# Altium schematic sheet bluetooth_candle.SchDoc
size B
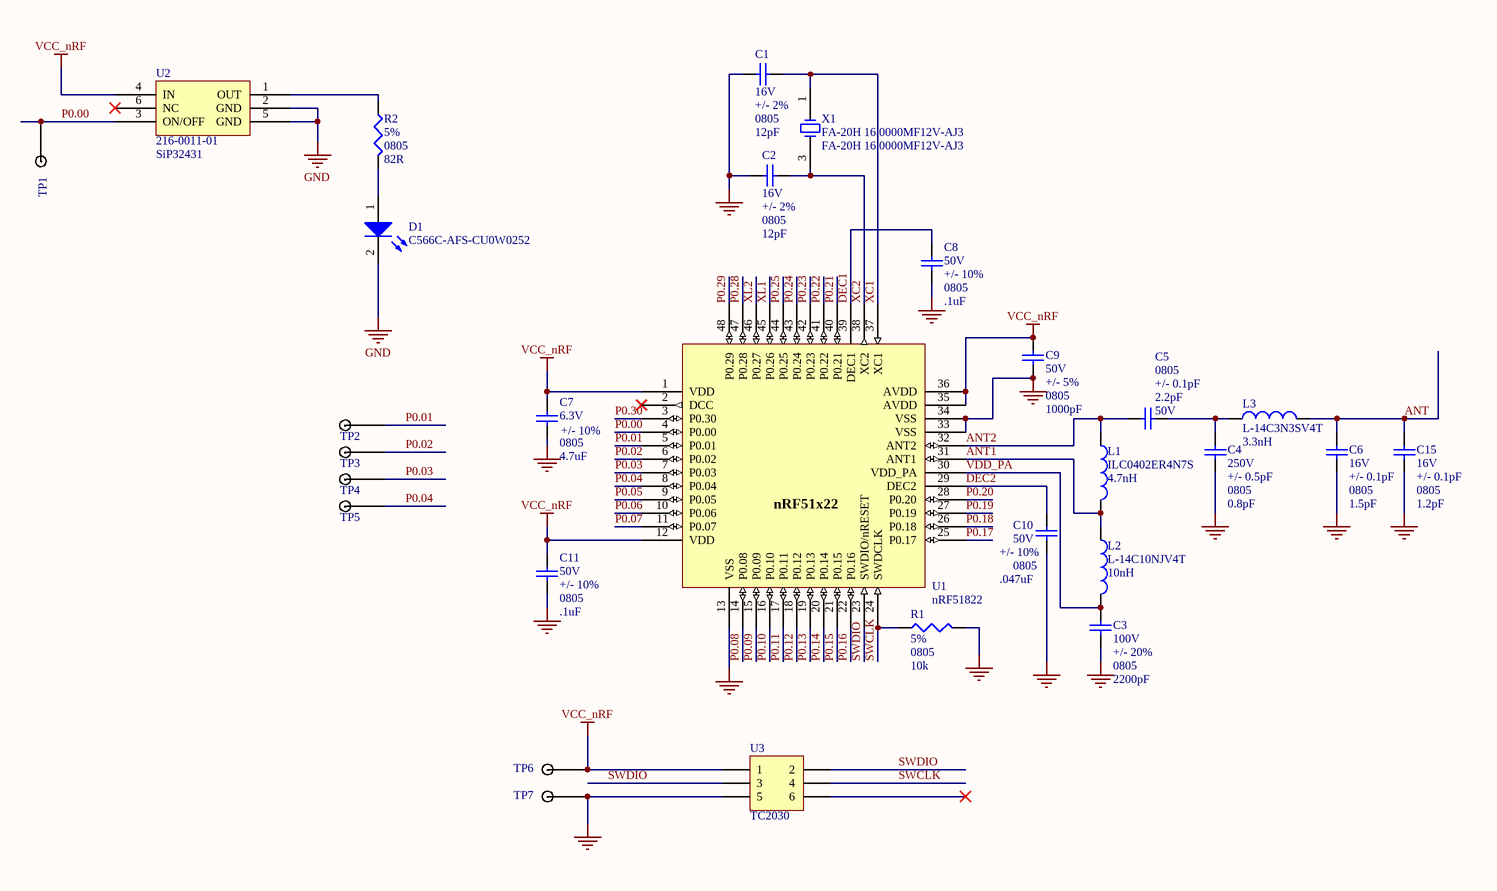
[diagram p0: bluetooth_candle.SchDoc]

## Parts
C1  value 12pF  Voltage: 16V  Tolerance: +/- 2%  PackageReference: 0805  [0805_Capacitor]  (hidden comment: VJ0805A120GXJCW1BC)
C2  value 12pF  Voltage: 16V  Tolerance: +/- 2%  PackageReference: 0805  [0805_Capacitor]  (hidden comment: VJ0805A120GXJCW1BC)
C3  value 2200pF  Voltage: 100V  Tolerance: +/- 20%  PackageReference: 0805  [0805_Capacitor]  (hidden comment: C2012X7R2A222M085AA)
C4  value 0.8pF  Voltage: 250V  Tolerance: +/- 0.5pF  PackageReference: 0805  [0805_Capacitor]  (hidden comment: 251R15S0R8DV4E)
C5  value 2.2pF  Voltage: 50V  Tolerance: +/- 0.1pF  PackageReference: 0805  [0805_Capacitor]  (hidden comment: VJ0805A2R2BXAPW1BC)
C6  value 1.5pF  Voltage: 16V  Tolerance: +/- 0.1pF  PackageReference: 0805  [0805_Capacitor]  (hidden comment: VJ0805A1R5BXJPW1BC)
C7  value 4.7uF  Voltage: 6.3V  Tolerance: +/- 10%  PackageReference: 0805  [0805_Capacitor]  (hidden comment: C2012X5R0J475K125AA)
C8  value .1uF  Voltage: 50V  Tolerance: +/- 10%  PackageReference: 0805  [0805_Capacitor]  (hidden comment: C2012X7R1H104K085AA)
C9  value 1000pF  Voltage: 50V  Tolerance: +/- 5%  PackageReference: 0805  [0805_Capacitor]  (hidden comment: C2012C0G1H102J060AA)
C10  value .047uF  Voltage: 50V  Tolerance: +/- 10%  PackageReference: 0805  [0805_Capacitor]  (hidden comment: C2012X7R1H473K)
C11  value .1uF  Voltage: 50V  Tolerance: +/- 10%  PackageReference: 0805  [0805_Capacitor]  (hidden comment: C2012X7R1H104K085AA)
C15  value 1.2pF  Voltage: 16V  Tolerance: +/- 0.1pF  PackageReference: 0805  [0805_Capacitor]  (hidden comment: VJ0805A1R2BXJPW1BC)
D1  C566C-AFS-CU0W0252  [Radial_LED]
L1  ILC0402ER4N7S  value 4.7nH  [0402_Capacitor]
L2  L-14C10NJV4T  value 10nH  [0603_Capacitor]
L3  L-14C3N3SV4T  value 3.3nH  [0603_Capacitor]
R1  value 10k  Tolerance: 5%  PackageReference: 0805  [0805_RESISTOR]  (hidden comment: ERJ-6GEYJ103V)
R2  value 82R  Tolerance: 5%  PackageReference: 0805  [0805_RESISTOR]  (hidden comment: ERJ-P06J820V)
TP1  Test Point  [Test_Point]  (value not drawn)
TP2  Test Point  [Test_Point]  (value not drawn)
TP3  Test Point  [Test_Point]  (value not drawn)
TP4  Test Point  [Test_Point]  (value not drawn)
TP5  Test Point  [Test_Point]  (value not drawn)
TP6  Test Point  [Test_Point]  (value not drawn)
TP7  Test Point  [Test_Point]  (value not drawn)
U1  nRF51822  [NRF51822-QFN]
U2  216-0011-01  [SiP32431]
U3  TC2030  [TC2030]
X1  FA-20H 16.0000MF12V-AJ3  [XTAL-2x2.5mm]

## Nets
GND: C1.2 C2.2 C3.1 C4.1 C6.1 C7.1 C8.1 C9.1 C10.1 C11.1 C15.1 D1.2(K) R1.2 TP7.1 U1.13(VSS) U1.33(VSS) U1.34(VSS) U1.49 U2.2(GND) U2.5(GND) U3.5 X1.2(GND) X1.4(GND)
VCC_nRF: C7.2 C9.2 C11.2 TP6.1 U1.1(VDD) U1.12(VDD) U1.35(AVDD) U1.36(AVDD) U2.4(IN) U3.1
ANT: C6.2 C15.2 L3.2
ANT1: L1.2 L2.1 U1.31(ANT1)
ANT2: C5.2 L1.1 U1.32(ANT2)
DEC1: C8.2 U1.39(DEC1)
DEC2: C10.2 U1.29(DEC2)
P0.00: TP1.1 U1.4(P0.00) U2.3(ON/OFF)
P0.01: TP2.1 U1.5(P0.01)
P0.02: TP3.1 U1.6(P0.02)
P0.03: TP4.1 U1.7(P0.03)
P0.04: TP5.1 U1.8(P0.04)
P0.05: U1.9(P0.05)
P0.06: U1.10(P0.06)
P0.07: U1.11(P0.07)
P0.08: U1.14(P0.08)
P0.09: U1.15(P0.09)
P0.10: U1.16(P0.10)
P0.11: U1.17(P0.11)
P0.12: U1.18(P0.12)
P0.13: U1.19(P0.13)
P0.14: U1.20(P0.14)
P0.15: U1.21(P0.15)
P0.16: U1.22(P0.16)
P0.17: U1.25(P0.17)
P0.18: U1.26(P0.18)
P0.19: U1.27(P0.19)
P0.20: U1.28(P0.20)
P0.21: U1.40(P0.21)
P0.22: U1.41(P0.22)
P0.23: U1.42(P0.23)
P0.24: U1.43(P0.24)
P0.25: U1.44(P0.25)
P0.28: U1.47(P0.28)
P0.29: U1.48(P0.29)
P0.30: U1.3(P0.30)
SWCLK: R1.1 U1.24(SWDCLK) U3.4
SWDIO: U1.23(SWDIO/nRESET) U3.2 U3.3
VDD_PA: C3.2 L2.2 U1.30(VDD_PA)
XC1: C1.1 U1.37(XC1) X1.1
XC2: C2.1 U1.38(XC2) X1.3
XL1: U1.45(P0.26)
XL2: U1.46(P0.27)
NetC4_2: C4.2 C5.1 L3.1
NetD1_1: D1.1(A) R2.2
NetR2_1: R2.1 U2.1(OUT)

Not connected (* = marked no-connect by the designer): U1 2(DCC)*; U2 6(NC)*; U3 6*

## Notes on the sheet
- (in symbol nRF51822) nRF51x22

## Library data of the parts
C1 C2 = VJ0805A120GXJCW1BC: CAPACITOR, CERAMIC, 12pF, 0805, 16V, +/-2%; Manufacturer: Vishay; Mfg PN: VJ0805A120GXJCW1BC
C3 = C2012X7R2A222M085AA: CAPACITOR, CERAMIC, 2200pF, 0805, 100V, +/-20%; Manufacturer: TDK; Mfg PN: C2012X7R2A222M085AA
C4 = 251R15S0R8DV4E: CAPACITOR, CERAMIC, 0.8pF, 0805, 250V, +/-0.5pF; Manufacturer: Johanson Technology; Mfg PN: 251R15S0R8DV4E
C5 = VJ0805A2R2BXAPW1BC: CAPACITOR, CERAMIC, 2.2pF, 0805, 50V, +/-0.1pF; Manufacturer: Vishay; Mfg PN: VJ0805A2R2BXAPW1BC
C6 = VJ0805A1R5BXJPW1BC: CAPACITOR, CERAMIC, 1.5pF, 0805, 16V, +/-0.1pF; Manufacturer: Vishay; Mfg PN: VJ0805A1R5BXJPW1BC
C7 = C2012X5R0J475K125AA: CAPACITOR CERAMIC, 4.7uF, 0805, 6.3V, +/-10%; Manufacturer: TDK; Mfg PN: C2012X5R0J475K125AA
C8 C11 = C2012X7R1H104K085AA: CAPACITOR, CERAMIC, 0.1uF, 0805, 50V, +/-10%; Manufacturer: TDK; Mfg PN: C2012X7R1H104K085AA
C9 = C2012C0G1H102J060AA: CAPACITOR, CERAMIC, 1000pF, 0805, 50V, +/-5%; Manufacturer: TDK; Mfg PN: C2012C0G1H102J060AA
C10 = C2012X7R1H473K: CAPACITOR, CERAMIC, .047uF, 0805, 50V, +/-10%; Manufacturer: TDK; Mfg PN: C2012X7R1H473K
C15 = VJ0805A1R2BXJPW1BC: CAPACITOR, CERAMIC, 1.2pF, 0805, 16V, +/-0.1pF; Manufacturer: Vishay; Mfg PN: VJ0805A1R2BXJPW1BC
D1 = C566C-AFS-CU0W0252: LED 5MM OVAL AMBER 591NM; Viewing Angle: 70,35; Forward Voltage: 2.1v; Forward Current: 20mA; Peak Wavelength: 591nm; Color: Amber
L1 = ILC0402ER4N7S: INDUCTOR 4.7NH +/- 0.1NH SMD; Manufacturer: Vishay; Tolerance: 0.1nH; Manufacturer PN: ILC0402ER4N7S
L2 = L-14C10NJV4T: INDUCTOR 10nH +/- 5% SMD; Manufacturer: Johanson Technology; Tolerance: +/- 5%; Manufacturer PN: L-14C10NJV4T
L3 = L-14C3N3SV4T: INDUCTOR 3.3nH +/- 0.3NH SMD; Manufacturer: Johanson Technology; Tolerance: +/- 0.3nH; Manufacturer PN: L-14C3N3SV4T
R1 = ERJ-6GEYJ103V: RESISTOR, 10k, 0805, 5%; Manufacturer: Panasonic; Power: 1/8W; Mfg PN: ERJ-6GEYJ103V
R2 = ERJ-P06J820V: RESISTOR, 82R, 0805, 5%; Manufacturer: Panasonic; Power: 1/2W; Mfg PN: ERJ-P06J820V
U1 = nRF51822: IC BLUETOOTH MCU 32BIT; Part Number: nRF51x22-Q48-6x6_DCDC; Manufacturer: Nordic Semiconductor; Note: nRF51x22 - QFN48 6x6 0.4mm pitch; Manufacturer Part Number: *; Footprint: QFN-48; Pin Count: 48
U2 = SiP32431: IC LOAD SWITCH SC70-6; Manufacturer: Fairchild Semiconductor; Mfg PN: SiP32431
U3 = TC2030: TC2030 PROGRAMMING FOOTPRINT
X1 = FA-20H 16.0000MF12V-AJ3: CRYSTAL 16MHz 10PPM 8.0pF; Manufacturer: Epson; Capacitance: 8pF; Frequency: 16MHz; Mfg PN: FA-20H 16.0000MF12V-AJ3